# Altium project UltraZohm_Digital_Incremental_Encoder_v2.PrjPCB
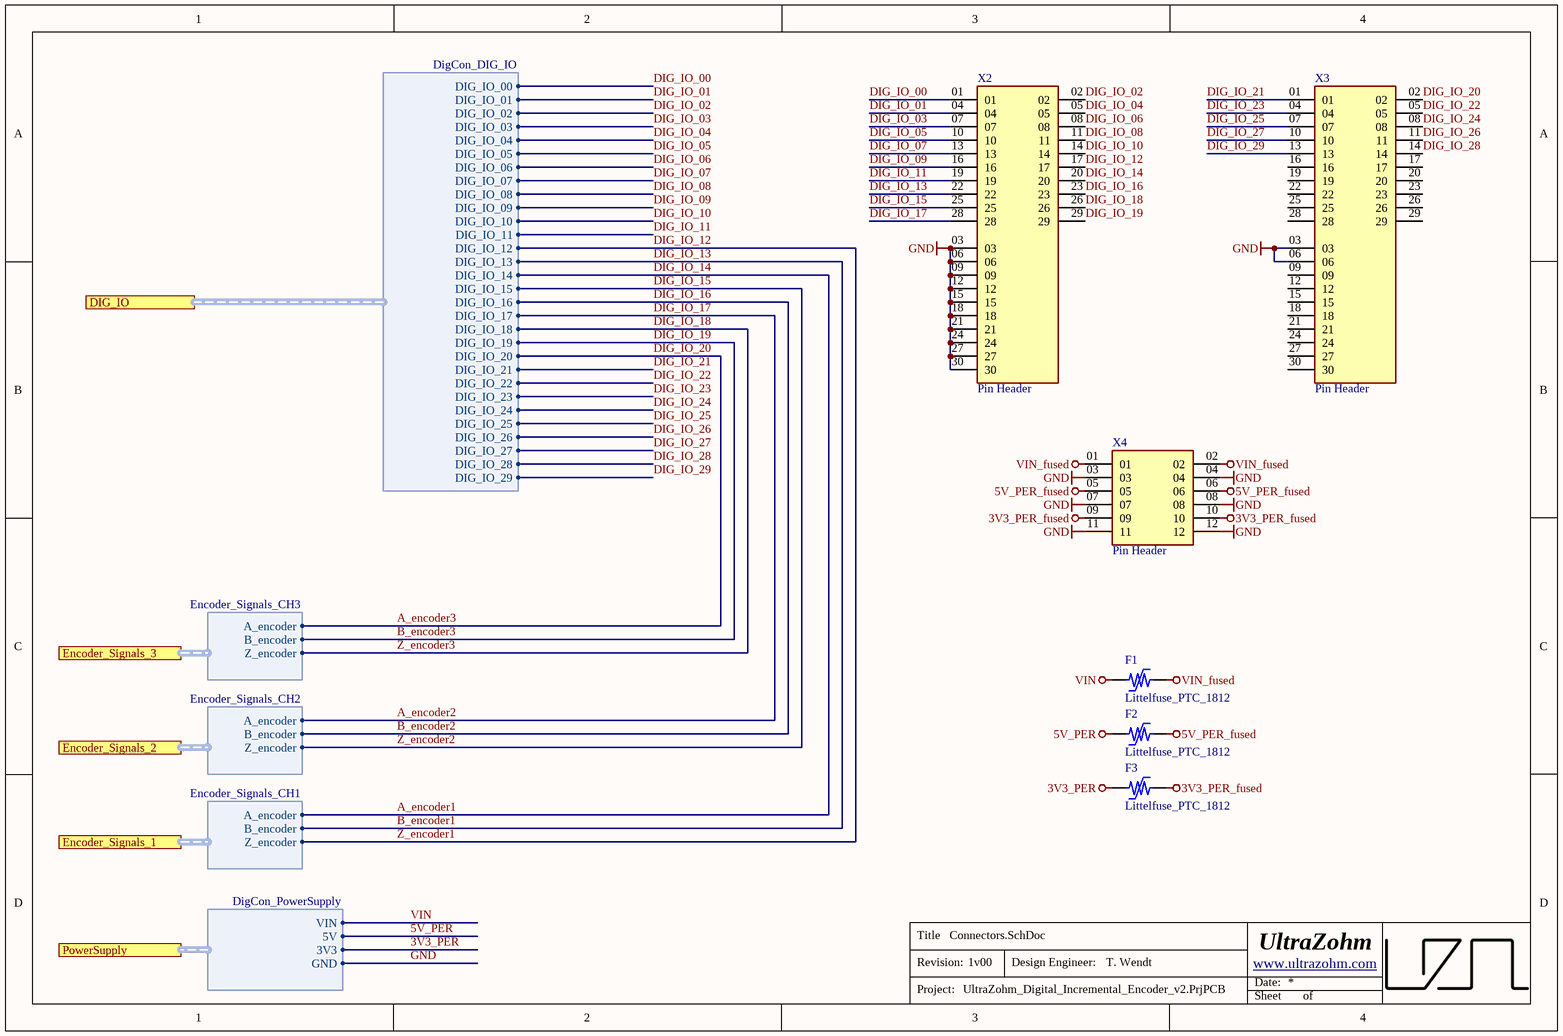
[diagram p0: Connectors.SchDoc]
Author: T. Wendt; AuthorParam: T. Wendt; Date: 11/2019; FinDate: 2020/01; ProjectNameCustom: UltraZohm_DigitalVoltage; ProjectRevision: 1v00
4 sheets, 45 parts. Net scope: hierarchical (ports join the sheet entries above them; power ports are global).
Board file: UZ_D_IncrEncd_v2.PcbDoc
Sheets:
  Connectors.SchDoc
  TopSheet.SchDoc
    CarrierConnector = DigitalCarrierJack.SchDoc
  Encoder.SchDoc

## Sheet Connectors.SchDoc
size A4; Author: T. Wendt; CompanyName: Technische Hochschule Nürnberg Georg Simon Ohm; Organization: UltraZohm; Address1: Kesslerplatz 12; Address2: 90489 Nürnberg; Address3: GERMANY; Website: www.ultrazohm.com

### Parts
(Parts that share a designator on the sheet are numbered #1, #2 ... from top to bottom, then left to right.)
F1#1  Littelfuse_PTC_1812  [1812_PTC_Polyfuse_Littelfuse]
F2#1  Littelfuse_PTC_1812  [1812_PTC_Polyfuse_Littelfuse]
F3#1  Littelfuse_PTC_1812  [1812_PTC_Polyfuse_Littelfuse]
X2#1  Pin Header  [SAMTEC_TSW-110-07-F-T]
X3#1  Pin Header  [SAMTEC_TSW-110-07-F-T]
X4#1  Pin Header  [SAMTEC_TSW-106-07-F-D]

### Ports
DIG_IO (harness DigCon_DIG_IO), Encoder_Signals_1 (harness Encoder_Signals_CH1), Encoder_Signals_2 (harness Encoder_Signals_CH2), Encoder_Signals_3 (harness Encoder_Signals_CH3), PowerSupply (harness DigCon_PowerSupply)

### Harnesses
Encoder_Signals_CH3: A_encoder, B_encoder, Z_encoder
Encoder_Signals_CH2: A_encoder, B_encoder, Z_encoder
Encoder_Signals_CH1: A_encoder, B_encoder, Z_encoder
DigCon_DIG_IO: DIG_IO_01, DIG_IO_02, DIG_IO_03, DIG_IO_04, DIG_IO_05, DIG_IO_06, DIG_IO_07, DIG_IO_08, DIG_IO_09, DIG_IO_10, DIG_IO_11, DIG_IO_12, DIG_IO_13, DIG_IO_14, DIG_IO_15, DIG_IO_16, DIG_IO_17, DIG_IO_18, DIG_IO_19, DIG_IO_20, DIG_IO_21, DIG_IO_22, DIG_IO_23, DIG_IO_24, DIG_IO_25, DIG_IO_26, DIG_IO_27, DIG_IO_28, DIG_IO_29, DIG_IO_00
DigCon_PowerSupply: GND, 3V3, 5V, VIN

### Nets
3V3_PER: F3#1.1 ; port PowerSupply.3V3
3V3_PER_fused: F3#1.2 X4#1.09 X4#1.10
5V_PER: F2#1.1 ; port PowerSupply.5V
5V_PER_fused: F2#1.2 X4#1.05 X4#1.06
GND: X2#1.03 X2#1.06 X2#1.09 X2#1.12 X2#1.15 X2#1.18 X2#1.21 X2#1.24 X2#1.27 X2#1.30 X3#1.03 X3#1.06 X4#1.03 X4#1.04 X4#1.07 X4#1.08 X4#1.11 X4#1.12 ; port PowerSupply.GND
VIN: F1#1.1 ; port PowerSupply.VIN
VIN_fused: F1#1.2 X4#1.01 X4#1.02
A_encoder1: X2#1.20 ; port Encoder_Signals_1.A_encoder, port DIG_IO.DIG_IO_14  [also labelled DIG_IO_14]
A_encoder2: X2#1.28 ; port Encoder_Signals_2.A_encoder, port DIG_IO.DIG_IO_17  [also labelled DIG_IO_17]
A_encoder3: X3#1.02 ; port Encoder_Signals_3.A_encoder, port DIG_IO.DIG_IO_20  [also labelled DIG_IO_20]
B_encoder1: X2#1.22 ; port Encoder_Signals_1.B_encoder, port DIG_IO.DIG_IO_13  [also labelled DIG_IO_13]
B_encoder2: X2#1.23 ; port Encoder_Signals_2.B_encoder, port DIG_IO.DIG_IO_16  [also labelled DIG_IO_16]
B_encoder3: X2#1.29 ; port Encoder_Signals_3.B_encoder, port DIG_IO.DIG_IO_19  [also labelled DIG_IO_19]
DIG_IO_00: X2#1.01 ; port DIG_IO.DIG_IO_00
DIG_IO_01: X2#1.04 ; port DIG_IO.DIG_IO_01
DIG_IO_02: X2#1.02 ; port DIG_IO.DIG_IO_02
DIG_IO_03: X2#1.07 ; port DIG_IO.DIG_IO_03
DIG_IO_04: X2#1.05 ; port DIG_IO.DIG_IO_04
DIG_IO_05: X2#1.10 ; port DIG_IO.DIG_IO_05
DIG_IO_06: X2#1.08 ; port DIG_IO.DIG_IO_06
DIG_IO_07: X2#1.13 ; port DIG_IO.DIG_IO_07
DIG_IO_08: X2#1.11 ; port DIG_IO.DIG_IO_08
DIG_IO_09: X2#1.16 ; port DIG_IO.DIG_IO_09
DIG_IO_10: X2#1.14 ; port DIG_IO.DIG_IO_10
DIG_IO_11: X2#1.19 ; port DIG_IO.DIG_IO_11
DIG_IO_12: X2#1.17 ; port Encoder_Signals_1.Z_encoder, port DIG_IO.DIG_IO_12  [also labelled Z_encoder1]
DIG_IO_15: X2#1.25 ; port Encoder_Signals_2.Z_encoder, port DIG_IO.DIG_IO_15  [also labelled Z_encoder2]
DIG_IO_18: X2#1.26 ; port Encoder_Signals_3.Z_encoder, port DIG_IO.DIG_IO_18  [also labelled Z_encoder3]
DIG_IO_21: X3#1.01 ; port DIG_IO.DIG_IO_21
DIG_IO_22: X3#1.05 ; port DIG_IO.DIG_IO_22
DIG_IO_23: X3#1.04 ; port DIG_IO.DIG_IO_23
DIG_IO_24: X3#1.08 ; port DIG_IO.DIG_IO_24
DIG_IO_25: X3#1.07 ; port DIG_IO.DIG_IO_25
DIG_IO_26: X3#1.11 ; port DIG_IO.DIG_IO_26
DIG_IO_27: X3#1.10 ; port DIG_IO.DIG_IO_27
DIG_IO_28: X3#1.14 ; port DIG_IO.DIG_IO_28
DIG_IO_29: X3#1.13 ; port DIG_IO.DIG_IO_29

Not connected (* = marked no-connect by the designer): X3#1 09 12 15 16 17 18 19 20 21 22 23 24 25 26 27 28 29 30

### Notes on the sheet
- Title
- Revision:
- Design Engineer:
- Date:
- Project:
- Sheet
- of

### Library data of the parts
F1#1 F2#1 F3#1 = Littelfuse_PTC_1812: POLYSWITCH RESETTABLE DEVICES; MPN: miniASMDC110F/24; Value: PTC, 1.1 A, 24V; Voltage: 24V; Trip Current: 2.2A; Hold Current: 1.1A; Resistance: 0.18 Ohm; Type: Fuse; Nominal current: 1 A; Created from: MHlatky; MF: Littelfuse; Created: 2019_02_10_AGeiger; Package: 1812; ComponentLink1URL: https://www.littelfuse.com/~/media/electronics/datasheets/resettable_ptcs/littelfuse_ptc_surface_mount_catalog_datasheet.pdf.pdf; ComponentLink1Description: Datasheet; Manufacturer Part Number: Littelfuse_PTC_1812; PartID: 5; Created On: 07.05.2021 06:50:33; Component Type: Littelfuse_PTC_1812; Last Updated: 10.03.2022 18:07:30; Manufacturer: Littelfuse; Mounting Type: SMD; Operating Temperature: -40 - 85 °C; Supplier 1: Mouser; Supplier Part Number 1: 530-0ZCG0150BF2C; Live Cycle Status: 1
X2#1 X3#1 = TSW-110-07-F-T: THROUGH-HOLE .025" SQ POST HEADER; Manufacturer: SAMTEC; MF: Samtec Inc.; Created from: MHlatky; Value: *; MP: TSW-110-07-F-T; Package: None; Price: None; Availability: Unavailable; Manufacturer Part Number: TSW-110-07-F-T; PartID: 7; Created On: 22.11.2021 15:31:45; ComponentLink1Description: Datasheet; ComponentLink1URL: https://www.mouser.de/datasheet/2/527/tsw_th-2854687.pdf; Component Type: Pin Header; Device Package: THT; Last Updated: 20.12.2021 07:38:08; Mounting Type: THT; Operating Temperature: -55 +125 °C; Series: TSW; Supplier 1: Mouser; Supplier Part Number 1: 200-TSW11007FT; Type: Pin Header; Live Cycle Status: 1; Stock number: not stored
X4#1 = TSW-106-07-F-D: THROUGH-HOLE .025" SQ POST HEADER; MF: Samtec; Created from: MHlatky; MP: TSW-106-07-F-D; Price: None; Package: None; Value: *; Availability: Unavailable; Manufacturer Part Number: TSW-106-07-F-D; PartID: 8; Created On: 22.11.2021 15:31:45; ComponentLink1Description: Datasheet; ComponentLink1URL: https://www.mouser.de/datasheet/2/527/tsw_th-2854687.pdf; Component Type: Pin Header; Device Package: THT; Last Updated: 20.12.2021 07:38:08; Manufacturer: SAMTEC; Mounting Type: THT; Operating Temperature: -55 +125 °C; Series: TSW; Supplier 1: Mouser; Supplier Part Number 1: 200-TSW10607FD; Type: Pin Header; Live Cycle Status: 1; Stock number: not stored

## Sheet TopSheet.SchDoc
size A4; Author: T. Wendt; CompanyName: Technische Hochschule Nürnberg Georg Simon Ohm; Organization: UltraZohm; Address1: Kesslerplatz 12; Address2: 90489 Nürnberg; Address3: GERMANY; DocumentNumber: 1; SheetNumber: 1; SheetTotal: 3; Website: www.ultrazohm.com
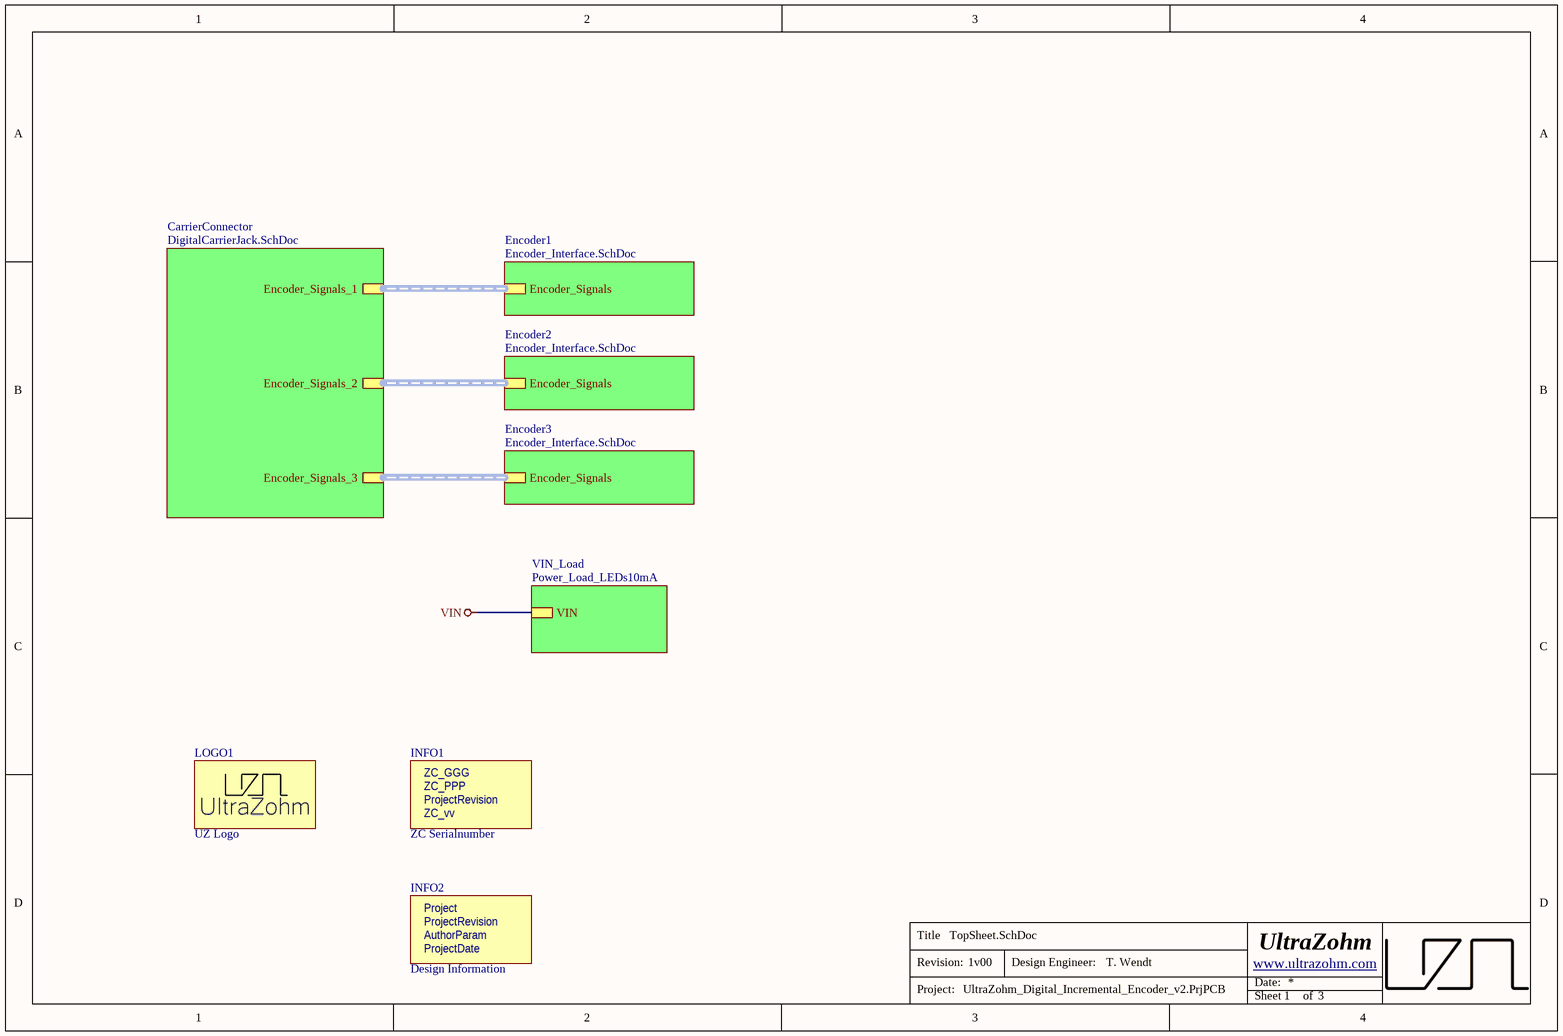
[diagram p1: TopSheet.SchDoc]

### Parts
INFO1  ZC Serialnumber  [ZC-Serial]  (no BOM)
INFO2  Design Information  [Design_info]  (no BOM)
LOGO1  UZ Logo  [UZ_Logo_small]  (no BOM)

### Sub-sheets
CarrierConnector = DigitalCarrierJack.SchDoc: Encoder_Signals_2 (harness Encoder_Signals), Encoder_Signals_1 (harness Encoder_Signals), Encoder_Signals_3 (harness Encoder_Signals)
Encoder1 = Encoder_Interface.SchDoc (file not in this document): Encoder_Signals (harness Encoder_Signals)
Encoder2 = Encoder_Interface.SchDoc (file not in this document): Encoder_Signals (harness Encoder_Signals)
Encoder3 = Encoder_Interface.SchDoc (file not in this document): Encoder_Signals (harness Encoder_Signals)
VIN_Load = Power_Load_LEDs10mA (file not in this document): VIN

### Buses and harness runs
harness sheet CarrierConnector/Encoder_Signals_1 = sheet Encoder1/Encoder_Signals
harness sheet CarrierConnector/Encoder_Signals_2 = sheet Encoder2/Encoder_Signals
harness sheet CarrierConnector/Encoder_Signals_3 = sheet Encoder3/Encoder_Signals

### Notes on the sheet
- Title
- Revision:
- Design Engineer:
- Date:
- Project:
- Sheet
- of
- (in symbol Design Information) Project; ProjectRevision; AuthorParam; ProjectDate
- (in symbol ZC-Serial) ZC_GGG; ZC_PPP; ProjectRevision; ZC_vv

### Library data of the parts
INFO1 = ZC-Serial: Manufacturer: UltraZohm; Value: GGG-PPP-VVvv; Created from: FRosner; Manufacturer Part Number: ZC-Serial; PartID: 58; Created On: 15/04/2025 09:17:14; ComponentLink1Description: https://docs.ultrazohm.com/; ComponentLink1URL: homepage; Component Type: ZC Serialnumber; Last Updated: 15/04/2025 09:17:14; Supplier 1: -; Supplier Part Number 1: -; Type: Serial Number; Live Cycle Status: 1
INFO2 = Design Information: Manufacturer: UltraZohm; Created from: MGremer; Manufacturer Part Number: Design Information; PartID: 12; Created On: 03/11/2021 09:04:23; ComponentLink1Description: https://docs.ultrazohm.com/; ComponentLink1URL: homepage; Component Type: Design Information; Last Updated: 15/04/2025 09:29:36; Supplier 1: -; Supplier Part Number 1: -; Type: Design Information; Value: Design Information; Live Cycle Status: 1
LOGO1 = Logo small: Manufacturer: UltraZohm; Created from: MGremer; Created: Jan2021_Liegmann; Value: Logo; Manufacturer Part Number: Logo small; PartID: 10; Created On: 03.11.2021 09:04:23; ComponentLink1Description: https://docs.ultrazohm.com/; ComponentLink1URL: homepage; Component Type: Logo; Last Updated: 03.11.2021 09:05:50; Supplier 1: -; Supplier Part Number 1: -; Type: Logo; Live Cycle Status: 1

## Sheet DigitalCarrierJack.SchDoc
size A4; Author: T. Wendt; CompanyName: Technische Hochschule Nürnberg Georg Simon Ohm; Organization: UltraZohm; Address1: Kesslerplatz 12; Address2: 90489 Nürnberg; Address3: GERMANY; DocumentNumber: 2; SheetNumber: 2; SheetTotal: 3; Website: www.ultrazohm.com
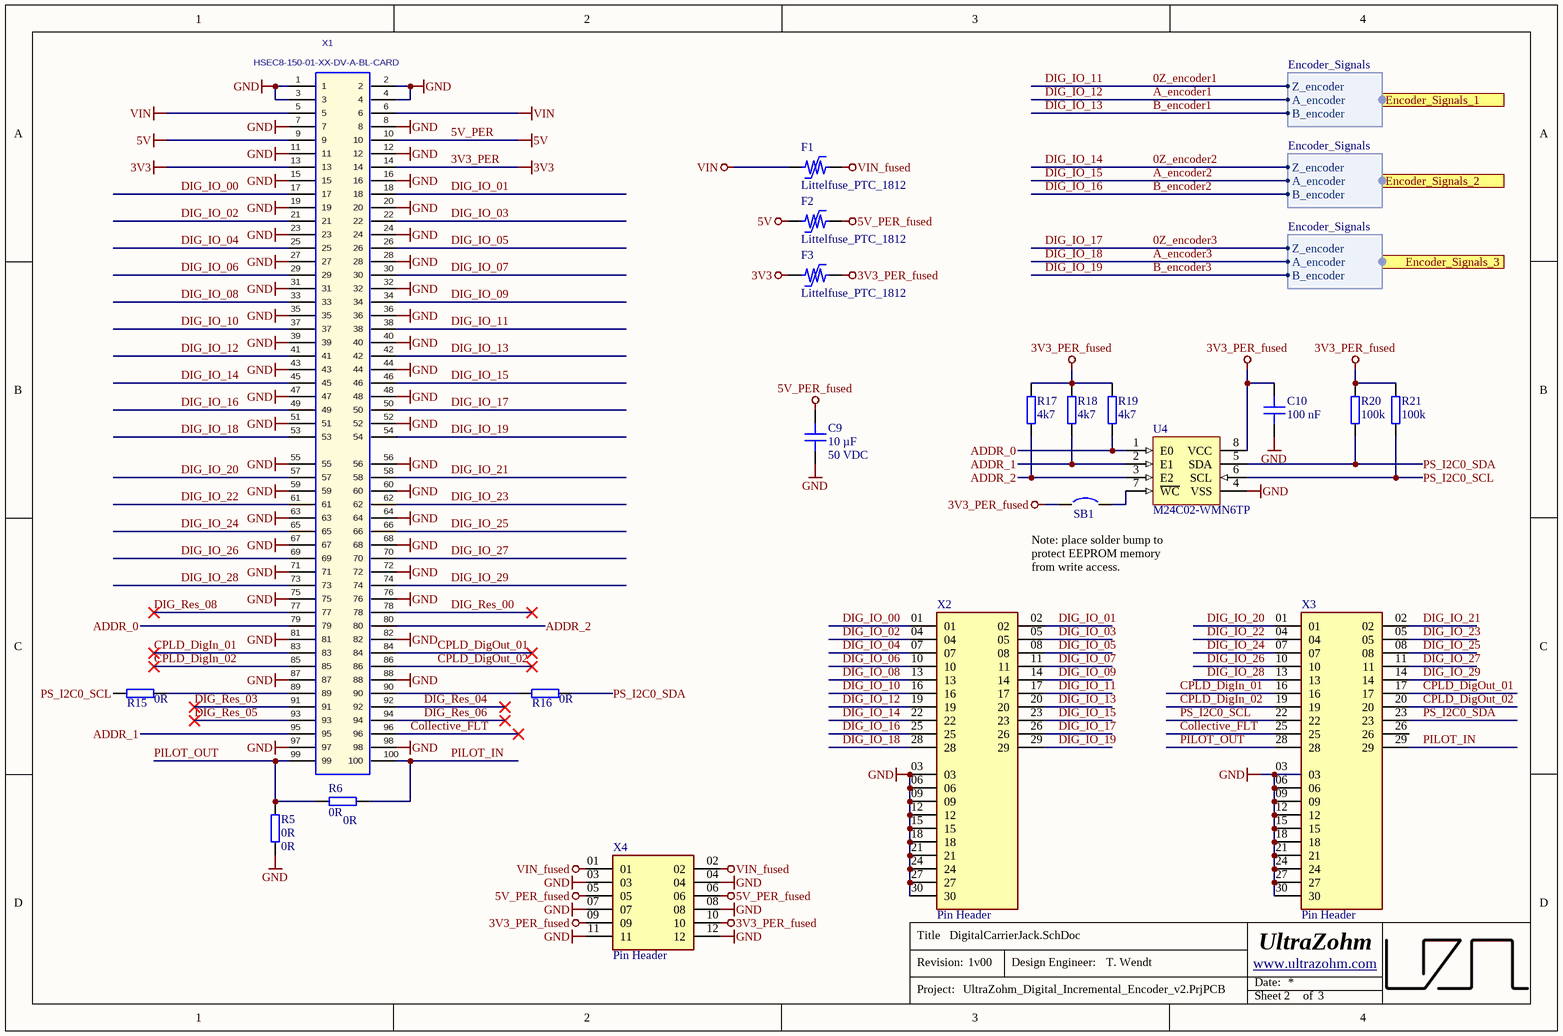
[diagram p2: DigitalCarrierJack.SchDoc]

### Parts
(Parts that share a designator on the sheet are numbered #1, #2 ... from top to bottom, then left to right.)
C9  10 µF  Voltage Rating: 50 VDC  [C_1206]
C10  100 nF  [C_0603]
F1#2  Littelfuse_PTC_1812  [1812_PTC_Polyfuse_Littelfuse]
F2#2  Littelfuse_PTC_1812  [1812_PTC_Polyfuse_Littelfuse]
F3#2  Littelfuse_PTC_1812  [1812_PTC_Polyfuse_Littelfuse]
R5  0R  [RES 0603_1608]
R6  0R  [RES 0603_1608]
R15  0R  [RES 0603_1608]
R16  0R  [RES 0603_1608]
R17  4k7  [RES 0603_1608]
R18  4k7  [RES 0603_1608]
R19  4k7  [RES 0603_1608]
R20  100k  [RES 0603_1608]
R21  100k  [RES 0603_1608]
SB1  (no value)  [SB_0603]  (no BOM)
U4  M24C02-WMN6TP  [D0008A_N]
X1  HSEC8-150-01-XX-DV-A-BL-CARD  [HSEC8-150-01-XX-DV-A-BL-CARD]  (no BOM)
X2#2  Pin Header  [SAMTEC_TSW-110-07-F-T]
X3#2  Pin Header  [SAMTEC_TSW-110-07-F-T]
X4#2  Pin Header  [SAMTEC_TSW-106-07-F-D]

### Ports
Encoder_Signals_1 (harness Encoder_Signals), Encoder_Signals_2 (harness Encoder_Signals), Encoder_Signals_3 (harness Encoder_Signals)

### Harnesses
Encoder_Signals: A_encoder, B_encoder, Z_encoder

### Nets
3V3_PER: F3#2.1 X1.13 X1.14  [also labelled 3V3]
3V3_PER_fused: C10.2 F3#2.2 R17.2 R18.2 R19.2 R20.2 R21.2 SB1.1 U4.8(VCC) X4#2.09 X4#2.10
5V_PER: F2#2.1 X1.9 X1.10  [also labelled 5V]
5V_PER_fused: C9.2 F2#2.2 X4#2.05 X4#2.06
GND: C9.1 C10.1 R5.1 U4.4(VSS) X1.1 X1.2 X1.3 X1.4 X1.7 X1.8 X1.11 X1.12 X1.15 X1.16 X1.19 X1.20 X1.23 X1.24 X1.27 X1.28 X1.31 X1.32 X1.35 X1.36 X1.39 X1.40 X1.43 X1.44 X1.47 X1.48 X1.51 X1.52 X1.55 X1.56 X1.59 X1.60 X1.63 X1.64 X1.67 X1.68 X1.71 X1.72 X1.75 X1.76 X1.81 X1.82 X1.87 X1.88 X1.97 X1.98 X2#2.03 X2#2.06 X2#2.09 X2#2.12 X2#2.15 X2#2.18 X2#2.21 X2#2.24 X2#2.27 X2#2.30 X3#2.03 X3#2.06 X3#2.09 X3#2.12 X3#2.15 X3#2.18 X3#2.21 X3#2.24 X3#2.27 X3#2.30 X4#2.03 X4#2.04 X4#2.07 X4#2.08 X4#2.11 X4#2.12
VIN: F1#2.1 X1.5 X1.6
VIN_fused: F1#2.2 X4#2.01 X4#2.02
0Z_encoder1: X1.38 X2#2.17 ; port Encoder_Signals_1.Z_encoder  [also labelled DIG_IO_11]
0Z_encoder2: X1.45 X2#2.22 ; port Encoder_Signals_2.Z_encoder  [also labelled DIG_IO_14]
0Z_encoder3: X1.50 X2#2.26 ; port Encoder_Signals_3.Z_encoder  [also labelled DIG_IO_17]
A_encoder1: X1.41 X2#2.19 ; port Encoder_Signals_1.A_encoder  [also labelled DIG_IO_12]
A_encoder2: X1.46 X2#2.23 ; port Encoder_Signals_2.A_encoder  [also labelled DIG_IO_15]
A_encoder3: X1.53 X2#2.28 ; port Encoder_Signals_3.A_encoder  [also labelled DIG_IO_18]
ADDR_0: R19.1 U4.1(E0) X1.79
ADDR_1: R18.1 U4.2(E1) X1.95
ADDR_2: R17.1 U4.3(E2) X1.80
B_encoder1: X1.42 X2#2.20 ; port Encoder_Signals_1.B_encoder  [also labelled DIG_IO_13]
B_encoder2: X1.49 X2#2.25 ; port Encoder_Signals_2.B_encoder  [also labelled DIG_IO_16]
B_encoder3: X1.54 X2#2.29 ; port Encoder_Signals_3.B_encoder  [also labelled DIG_IO_19]
Collective_FLT: X1.96 X3#2.25
CPLD_DigIn_01: X1.83 X3#2.16
CPLD_DigIn_02: X1.85 X3#2.19
CPLD_DigOut_01: X1.84 X3#2.17
CPLD_DigOut_02: X1.86 X3#2.20
DIG_IO_00: X1.17 X2#2.01
DIG_IO_01: X1.18 X2#2.02
DIG_IO_02: X1.21 X2#2.04
DIG_IO_03: X1.22 X2#2.05
DIG_IO_04: X1.25 X2#2.07
DIG_IO_05: X1.26 X2#2.08
DIG_IO_06: X1.29 X2#2.10
DIG_IO_07: X1.30 X2#2.11
DIG_IO_08: X1.33 X2#2.13
DIG_IO_09: X1.34 X2#2.14
DIG_IO_10: X1.37 X2#2.16
DIG_IO_20: X1.57 X3#2.01
DIG_IO_21: X1.58 X3#2.02
DIG_IO_22: X1.61 X3#2.04
DIG_IO_23: X1.62 X3#2.05
DIG_IO_24: X1.65 X3#2.07
DIG_IO_25: X1.66 X3#2.08
DIG_IO_26: X1.69 X3#2.10
DIG_IO_27: X1.70 X3#2.11
DIG_IO_28: X1.73 X3#2.13
DIG_IO_29: X1.74 X3#2.14
DIG_Res_00: X1.78
DIG_Res_03: X1.91
DIG_Res_04: X1.92
DIG_Res_05: X1.93
DIG_Res_06: X1.94
DIG_Res_08: X1.77
PILOT_IN: R6.2 X1.100 X3#2.29
PILOT_OUT: R5.2 R6.1 X1.99 X3#2.28
PS_I2C0_SCL: R15.1 R21.1 U4.6(SCL) X3#2.22
PS_I2C0_SDA: R16.2 R20.1 U4.5(SDA) X3#2.23
NetR15_2: R15.2 X1.89
NetR16_1: R16.1 X1.90
NetSB1_2: SB1.2 U4.7(~{WC})

Not connected (* = marked no-connect by the designer): X3#2 26

### Notes on the sheet
- Note: place solder bump to protect EEPROM memory from write access.
- Title
- Revision:
- Design Engineer:
- Date:
- Project:
- Sheet
- of

### Library data of the parts
C9 = CGA5L1X7R1H106K160AC: Capacitor 1206, 50 VDC, 10 µF, X7R; Manufacturer: TDK; Tolerance: 10 %; Created from: MGremer; Manufacturer Part Number: CGA5L1X7R1H106K160AC; PartID: 25; Created On: 20.12.2020 13:54:13; ComponentLink1Description: Datasheet; ComponentLink1URL: https://product.tdk.com/info/en/catalog/datasheets/mlcc_automotive_general_en.pdf; Component Type: Capacitor 1206; Device Package: 1206; Last Updated: 27.05.2022 14:15:21; Mounting Type: SMD; Operating Temperature: -55 - 125°C; Series: CGA; Supplier 1: Mouser; Supplier Part Number 1: 810-CGA5L1X7R1H106K1; Type: Capacitor; Value: 10 µF; Live Cycle Status: 1; LCSC Part Number: C13585; Stock number: Labor SMD Container
C10 = CC0603KRX7R9BB104: Capacitor 0603, 50 VDC, 100 nF, X7R; Manufacturer: YAGEO; Tolerance: 10 %; Voltage Rating: 50 VDC; Created from: AGeiger; Manufacturer Part Number: CC0603KRX7R9BB104; PartID: 102; Created On: 22/08/2022 14:35:53; ComponentLink1Description: Datasheet; ComponentLink1URL: https://datasheet.lcsc.com/lcsc/1809301912_YAGEO-CC0603KRX7R9BB104_C14663.pdf; Component Type: Capacitor 0603; Device Package: 0603; Last Updated: 22/08/2022 14:35:53; Mounting Type: SMD; Operating Temperature: -55 - 125°C; Series: X7R; Supplier 1: LCSC; Supplier Part Number 1: C14663; Supplier 2: Mouser; Supplier Part Number 2: 603-CC603KRX7R9BB104; Type: Capacitor; Value: 100 nF; Live Cycle Status: 1; LCSC Part Number: C14663
F1#2 F2#2 F3#2 = Littelfuse_PTC_1812: as F1#1 on sheet Connectors; MF: Littelfuse; Created: 2019_02_10_AGeiger; Package: 1812; ComponentLink1URL: https://www.littelfuse.com/~/media/electronics/datasheets/resettable_ptcs/littelfuse_ptc_surface_mount_catalog_datasheet.pdf.pdf; ComponentLink1Description: Datasheet; Manufacturer Part Number: Littelfuse_PTC_1812; PartID: 5; Created On: 07.05.2021 06:50:33; Component Type: Littelfuse_PTC_1812; Last Updated: 27.05.2022 15:06:17; Manufacturer: Littelfuse; Mounting Type: SMD; Operating Temperature: -40 - 85 °C; Supplier 1: Mouser; Supplier Part Number 1: 530-0ZCG0150BF2C; Live Cycle Status: 1; LCSC Part Number: C70119
R5 R6 R15 R16 = RC0603JR-070RL: SMD resistor E24 series; Manufacturer: YAGEO; Tolerance: 5%; Created from: MGremer; Manufacturer Part Number: RC0603JR-070RL; PartID: 1; Created On: 14.12.2020 16:17:14; ComponentLink1Description: Datasheet; ComponentLink1URL: https://www.mouser.de/datasheet/2/447/PYu-RC_Group_51_RoHS_L_10-1664068.pdf; Component Type: SMD resistor; Device Package: 0603; Last Updated: 04.03.2021 09:09:42; Mounting Type: SMD; Supplier 1: Mouser; Supplier Part Number 1: 603-RC0603JR-070RL; Supplier 2: LCSC; Supplier Part Number 2: C21189; Type: Resistor; Value: 0R; Live Cycle Status: 1; Stock number: Labor SMD Container; LCSC Part Number: C21189
R17-R19 = RK73B1JTTD472J: SMD resistor E24 series; Manufacturer: KOA Speer; Tolerance: 5%; Created from: MGremer; Manufacturer Part Number: RK73B1JTTD472J; PartID: 90; Created On: 14.12.2020 16:17:14; ComponentLink1Description: Datasheet; ComponentLink1URL: https://www.mouser.de/datasheet/2/219/RK73B-1825463.pdf; Component Type: SMD resistor; Device Package: 0603; Last Updated: 27.05.2022 13:46:16; Mounting Type: SMD; Supplier 1: Mouser; Supplier Part Number 1: 660-RK73B1JTTD472J; Type: Resistor; Value: 4k7; Live Cycle Status: 1; Stock number: Labor SMD Container; LCSC Part Number: C23162
R20 R21 = RK73B1JTTD104J: SMD resistor E24 series; Manufacturer: KOA Speer; Tolerance: 5%; Created from: MGremer; Manufacturer Part Number: RK73B1JTTD104J; PartID: 122; Created On: 14.12.2020 16:17:14; ComponentLink1Description: Datasheet; ComponentLink1URL: https://www.mouser.de/datasheet/2/219/RK73B-1825463.pdf; Component Type: SMD resistor; Device Package: 0603; Last Updated: 27.05.2022 14:04:10; Mounting Type: SMD; Supplier 1: Mouser; Supplier Part Number 1: 660-RK73B1JTTD104J; Type: Resistor; Value: 100k; Live Cycle Status: 1; Stock number: Labor SMD Container; LCSC Part Number: C25803
SB1 = Solder Bump 0603: Created from: AGeiger; Revision: July-2002: Re-released for DXP Platform.; Manufacturer Part Number: Solder Bump 0603; PartID: 1; Created On: 09/01/2024 17:13:56; Component Type: Solder Bump; Device Package: 0603; Last Updated: 02/10/2025 12:53:47; Mounting Type: SMD; Value: Solder Bump 0603
U4 = M24C02-WMN6TP: 2Kbit I2C SOP-8 EEPROM ROHS; Manufacturer: STMicroelectronics; Created from: AGeiger; Manufacturer Part Number: M24C02-WMN6TP; PartID: 1; Created On: 19.11.2023 14:54:27; ComponentLink1Description: Datasheet; ComponentLink1URL: https://www.st.com/resource/en/datasheet/m24c01-w.pdf; Component Type: EEPROM; Device Package: SOIC-8; Last Updated: 19.11.2023 21:39:04; Mounting Type: SMD; Operating Temperature: -40 to +85 °C; Series: M24xxx; Supplier 1: Mouser; Supplier Part Number 1: 511-M24C02-WMN6TP; Supplier 2: LCSC; Supplier Part Number 2: C7562; Type: Memory; Value: M24C02-WMN6TP; LCSC Part Number: C7562
X1 = HSEC8-150-01-XX-DV-A-BL-CARD: Mating Card Layout for HSEC8-150-01-XX-DV-A-BL; Manufacturer: SAMTEC; Created: 2018_04_23_AGeiger; Value: HSEC8-150-01-XX-DV-A-BL-CARD
X2#2 X3#2 = TSW-110-07-F-T: as X2#1 on sheet Connectors; Value: *; MP: TSW-110-07-F-T; Package: None; Price: None; Availability: Unavailable; Manufacturer Part Number: TSW-110-07-F-T; PartID: 7; Created On: 22.11.2021 15:31:45; ComponentLink1Description: Datasheet; ComponentLink1URL: https://www.mouser.de/datasheet/2/527/tsw_th-2854687.pdf; Component Type: Pin Header; Device Package: THT; Last Updated: 20.12.2021 07:38:08; Mounting Type: THT; Operating Temperature: -55 +125 °C; Series: TSW; Supplier 1: Mouser; Supplier Part Number 1: 200-TSW11007FT; Type: Pin Header; Live Cycle Status: 1; Stock number: not stored
X4#2 = TSW-106-07-F-D: as X4#1 on sheet Connectors; MP: TSW-106-07-F-D; Price: None; Package: None; Value: *; Availability: Unavailable; Manufacturer Part Number: TSW-106-07-F-D; PartID: 8; Created On: 22.11.2021 15:31:45; ComponentLink1Description: Datasheet; ComponentLink1URL: https://www.mouser.de/datasheet/2/527/tsw_th-2854687.pdf; Component Type: Pin Header; Device Package: THT; Last Updated: 20.12.2021 07:38:08; Manufacturer: SAMTEC; Mounting Type: THT; Operating Temperature: -55 +125 °C; Series: TSW; Supplier 1: Mouser; Supplier Part Number 1: 200-TSW10607FD; Type: Pin Header; Live Cycle Status: 1; Stock number: not stored

## Sheet Encoder.SchDoc
size A4; Author: Michaela Hlatky; CompanyName: Technische Hochschule Nürnberg Georg Simon Ohm; Address1: Fürther Straße 250; Address2: 90429 Nürnberg; Address3: GERMANY; Revision: 2v00; SheetNumber: 4; SheetTotal: 4; CompanyName2: Institut ELSYS
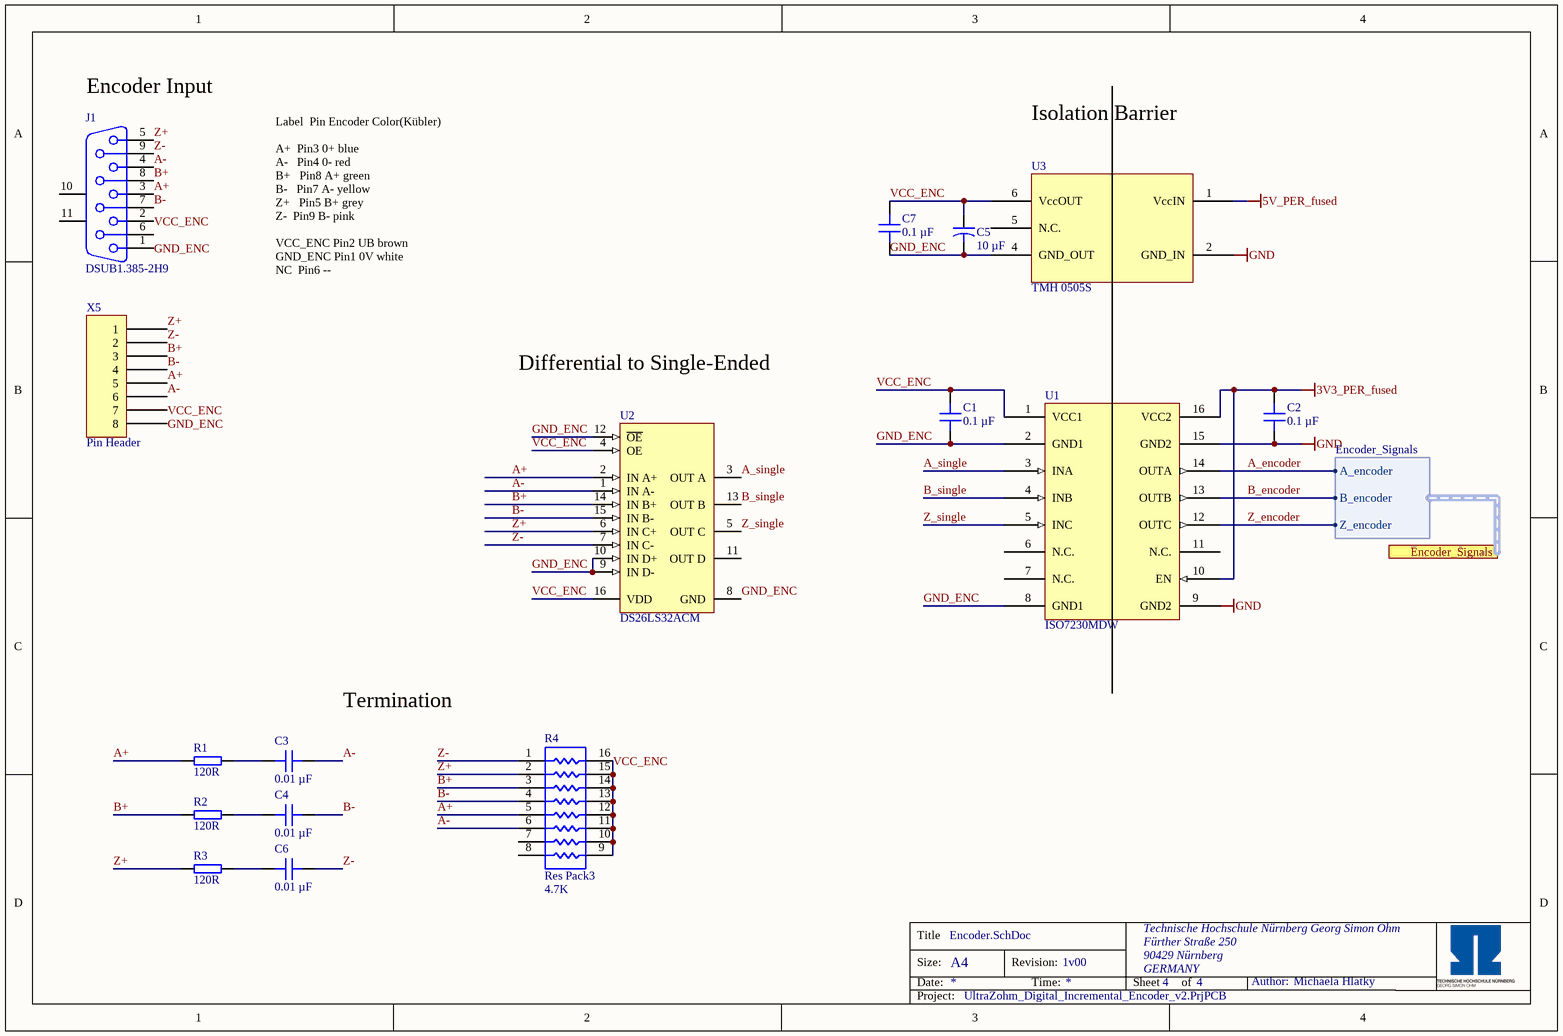
[diagram p3: Encoder.SchDoc]

### Parts
C1  0.1 µF  [C_0805]
C2  0.1 µF  [C_0805]
C3  0.01 µF  [C_0805]
C4  0.01 µF  [C_0805]
C5  10 µF  [CAPR5-4X5]
C6  0.01 µF  [C_0805]
C7  0.1 µF  [C_0805]
J1  DSUB1.385-2H9  [DSUB1.385-2H9]
R1  120R  [RES 0603_1608]
R2  120R  [RES 0603_1608]
R3  120R  [RES 0603_1608]
R4  Res Pack3  value 4.7K  [SO-16_N]
U1  ISO7230MDW  [TI ISO7230 SOIC]
U2  DS26LS32ACM  [M16A_M]
U3  TMH 0505S  [SIL-6(7)]
X5  Pin Header  [HDR1X8]

### Ports
Encoder_Signals (harness Encoder_Signals)

### Harnesses
Encoder_Signals: A_encoder, B_encoder, Z_encoder

### Nets
3V3_PER_fused: C2.2 U1.10(EN) U1.16(VCC2)
5V_PER_fused: U3.1(VccIN)
GND: C2.1 U1.9(GND2) U1.15(GND2) U3.2(GND_IN)
A+: J1.3 R1.1 R4.5 U2.2(IN_A+) X5.5
A-: C3.2 J1.4 R4.6 U2.1(IN_A-) X5.6
A_encoder: U1.14(OUTA) ; port Encoder_Signals.A_encoder
A_single: U1.3(INA) U2.3(OUT_A)
B+: J1.8 R2.1 R4.3 U2.14(IN_B+) X5.3
B-: C4.2 J1.7 R4.4 U2.15(IN_B-) X5.4
B_encoder: U1.13(OUTB) ; port Encoder_Signals.B_encoder
B_single: U1.4(INB) U2.13(OUT_B)
GND_ENC: C1.1 C5.2 C7.1 J1.1 U1.2(GND1) U1.8(GND1) U2.8(GND) U2.9(IN_D-) U2.10(IN_D+) U2.12(~{OE}) U3.4(GND_OUT) X5.8
VCC_ENC: C1.2 C5.1 C7.2 J1.2 R4.9 R4.10 R4.11 R4.12 R4.13 R4.14 R4.15 R4.16 U1.1(VCC1) U2.4(OE) U2.16(VDD) U3.6(VccOUT) X5.7
Z+: J1.5 R3.1 R4.2 U2.6(IN_C+) X5.1
Z-: C6.2 J1.9 R4.1 U2.7(IN_C-) X5.2
Z_encoder: U1.12(OUTC) ; port Encoder_Signals.Z_encoder
Z_single: U1.5(INC) U2.5(OUT_C)
NetC3_1: C3.1 R1.2
NetC4_1: C4.1 R2.2
NetC6_1: C6.1 R3.2

Not connected (* = marked no-connect by the designer): J1 6 10(MH1) 11(MH2); R4 7 8; U1 6(N.C.) 7(N.C.) 11(N.C.); U2 11(OUT_D); U3 5(N.C.)

### Notes on the sheet
- (near J1) Encoder Input
- Isolation Barrier
- Label		Pin	Encoder	Color(Kübler)
  A+		Pin3	0+	blue
  A- 		Pin4	0-	red
  B+ 		Pin8	A+	green
  B- 		Pin7	A-	yellow
  Z+ 		Pin5	B+	grey
  Z-		Pin9	B-	pink
  VCC_ENC	Pin2	UB	brown
  GND_ENC	Pin1	0V	white
  NC		Pin6	--
- Differential to Single-Ended
- Termination
- Title
- Size:
- Date:
- A4
- Revision:
- Time:
- Sheet
- of
- Author:
- Project:

### Library data of the parts
C1 C2 C7 = C0805C104J5RECTU: Capacitor 0805, 50 VDC, 0.1 µF, X7R; Manufacturer: KEMET; Tolerance: 5 %; Voltage Rating: 50 VDC; Created from: MGremer; Manufacturer Part Number: C0805C104J5RECTU; PartID: 17; Created On: 20.12.2020 13:54:13; ComponentLink1Description: Datasheet; ComponentLink1URL: https://www.mouser.de/datasheet/2/212/KEM_C1002_X7R_SMD-1102033.pdf; Component Type: Capacitor 0805; Device Package: 0805; Last Updated: 20.12.2020 16:34:30; Mounting Type: SMD; Operating Temperature: -55 - 125°C; Series: SMD Comm X7R; Supplier 1: Mouser; Supplier Part Number 1: 80-C0805C104J5RECTU; Type: Capacitor; Value: 0.1 µF; Live Cycle Status: 1; Stock number: Labor SMD Container
C3 C4 C6 = GRM21BR72A103KA01L: Capacitor 0805, 100 VDC, 0.01 µF, X7R; Manufacturer: Murata Electronics; Tolerance: 10 %; Voltage Rating: 100 VDC; Created from: MGremer; Manufacturer Part Number: GRM21BR72A103KA01L; PartID: 86; Created On: 20.12.2020 13:54:13; ComponentLink1Description: Datasheet; ComponentLink1URL: https://www.mouser.de/datasheet/2/281/1/GRM21BR72A103KA01_01C-1986947.pdf; Component Type: Capacitor 0805; Device Package: 0805; Last Updated: 17.11.2021 11:27:00; Mounting Type: SMD; Operating Temperature: -55 - 125°C; Series: GRM; Supplier 1: Mouser; Supplier Part Number 1: 81-GRM21BR72A103K; Type: Capacitor; Value: 0.01 µF; Live Cycle Status: 1; Stock number: not stored
C5 = CAPR5-4X5: Capacitor; 2 Leads; Created from: MHlatky; Published: 23-Sep-2002; PackageReference: CAPR5-4X5; Publisher: Altium Limited; PackageDescription: Capacitor; 2 Leads; Value: 10 µF; Manufacturer Part Number: CAPR5-4X5; PartID: 5; Created On: 25.05.2021 10:46:00; ComponentLink1Description: Datasheet; Component Type: Capacitor; Last Updated: 30.11.2021 13:37:41; Supplier Part Number 1: CAPR5-4X5; Type: Capacitor; Live Cycle Status: 1
J1 = DSUB1.385-2H9: Connector; D Subminiature; 9 Position; Right Angle; Pitch 1.385 mm; Manufacturer: Altium; PackageDocument: O; Positions: 9; Gender: Receptacle; Created from: MHlatky; Published: 15-Jun-2001; LatestRevisionDate: 17-Jul-2002; LatestRevisionNote: Re-released for DXP Platform.; DatasheetDocument: 1-Sep-1999; PackageReference: 788750; Publisher: Altium Limited; Orientation: Right Angle; Manufacturer Part Number: DSUB1.385-2H9; PartID: 15; Created On: 26.01.2021 09:19:51; ComponentLink1Description: Datasheet; ComponentLink1URL: [NULL]; Component Type: DSUB Connector; Device Package: -; Last Updated: 20.12.2021 09:43:18; Type: DSUB Connector; Live Cycle Status: 1; Stock number: not stored
R1-R3 = RK73B1JTTD121J: SMD resistor E24 series; Manufacturer: KOA Speer; Tolerance: 5%; Created from: MGremer; Manufacturer Part Number: RK73B1JTTD121J; PartID: 52; Created On: 14.12.2020 16:17:14; ComponentLink1Description: Datasheet; ComponentLink1URL: https://www.mouser.de/datasheet/2/219/RK73B-1825463.pdf; Component Type: SMD resistor; Device Package: 0603; Last Updated: 02.03.2021 14:07:32; Mounting Type: SMD; Supplier 1: Mouser; Supplier Part Number 1: 660-RK73B1JTTD121J; Type: Resistor; Value: 120R; Live Cycle Status: 1; Stock number: Labor SMD Container
R4 = Res Pack3: SOIC, 16-Leads, Body 9.9x3.9mm, Pitch 1.27mm, IPC Medium Density; Created from: MHlatky; Published: 24-Mar-1999; LatestRevisionDate: 29-May-2009; LatestRevisionNote: IPC-7351 Footprint Added.; PackageReference: SO-16; Publisher: Altium Limited; PackageDescription: 16-Pin Small Outline Integrated Circuit 1.27 mm Pitch; Code_JEDEC: MS-012-AC; Code_IPC: SOIC127P600-16; Manufacturer Part Number: Res Pack3; PartID: 207; Created On: 14.12.2020 16:17:14; ComponentLink1Description: Datasheet; Component Type: Res Pack3; Device Package: SOIC; Last Updated: 20.12.2021 09:54:47; Mounting Type: SMD; Supplier 1: Altium; Type: Resistor; Live Cycle Status: 1
U1 = ISO7230MDW: ISO723xx High-Speed, Triple-Channel Digital Isolators; Manufacturer: Analog Devices; Created from: MHlatky; Manufacturer Part Number: ISO7230MDW; PartID: 5; Created On: 26.01.2021 09:03:43; ComponentLink1Description: Datasheet; ComponentLink1URL: https://www.ti.com/lit/ds/symlink/iso7230m.pdf?HQS=dis-mous-null-mousermode-dsf-pf-null-wwe&ts=1639988443497&ref_url=https%253A%252F%252Fwww.mouser.de%252F; Component Type: Microcontroller; Last Updated: 17.06.2021 08:32:47; Mounting Type: SOIC; Operating Temperature: -40 - +125 °C; Supplier 1: Mouser; Supplier Part Number 1: 595-ISO7230MDW; Type: Microcontroller; Live Cycle Status: 1; Stock number: not stored
U2 = DS26LS32ACM: DS26LS32AC/DS26LS32C/DS26LS32M/DS26LS33M Quad Differential Line Receivers; Manufacturer: Texas Instruments; PackageTopMarking: NSUZXYTTE#*DS26LS32*ACM; PowerWise: N; CompType: Interface IC; Created from: MHlatky; Published: 4-Dec-2008; DatasheetVersion: May-1999; PackageVersion: revJ, Aug-1995; PackageReference: M16A; Publisher: Altium Limited; PackageDescription: Molded Package, SO, .150in Wide, 16 Lead; Supplier 1: Mouser; Supplier Part Number 1: 926-DS26LS32ACM; PartNumber: DS26LS32ACM; RoHS: N; PinCount: 16; Code_JEDEC: MS-012-AC; Code_IPC: SOIC127P600-16; ComponentLink1Description: Datasheet; ComponentLink1URL: https://media.digikey.com/pdf/Data%20Sheets/Texas%20Instruments%20PDFs/DS26LS32AC,C,M,DS26LS33M.pdf; ComponentLink2Description: DS26LS32AC Web Page; ComponentLink2URL: http://www.national.com/pf/DS/DS26LS32AC.html; ComponentLink3Description: M16A Package Page; ComponentLink3URL: http://www.national.com/packaging/folders/m16a.html; Manufacturer Part Number: DS26LS32ACM; PartID: 6; Created On: 26.01.2021 09:03:43; Component Type: Microcontroller; Last Updated: 17.06.2021 08:32:47; Mounting Type: SOIC; Operating Temperature: 0 - 70 °C; Type: Microcontroller; Live Cycle Status: 1; Stock number: not stored
U3 = TMH 0505S: ISOLIERTE DC-DC-WANDLER Product Type: DC/DC; Package Style: SIP; Output Power (W): 2; Input Voltage: 5 VDC +/-10%; Output 1 (Vdc): 5; Output 2 (Vdc): N/A; Output 3 (Vdc): N/A; Manufacturer: Traco; Created from: MHlatky; Manufacturer Part Number: TMH 0505S; PartID: 20; Created On: 16.11.2021 07:44:11; ComponentLink1Description: Datasheet; ComponentLink1URL: https://www.tracopower.com/products/tmh.pdf; Component Type: DC-DC Converter; Device Package: SIP; Last Updated: 16.11.2021 07:44:11; Mounting Type: SMD; Operating Temperature: -40 - 85 °C; Series: TMH; Supplier 1: Mouser; Supplier Part Number 1: 495-TMH-0505S; Type: isolated DC-DC Converter; Live Cycle Status: 1; Stock number: not stored
X5 = HDR1X8: 8 Pin; Created from: MHlatky; Manufacturer Part Number: HDR1X8; PartID: 9; Created On: 22.11.2021 15:31:45; ComponentLink1Description: Datasheet; Component Type: Pin Header; Last Updated: 20.12.2021 07:38:08; Supplier 1: Altium; Supplier Part Number 1: HDR1X8; Type: Pin Header; Live Cycle Status: 1; Stock number: not stored

## Nets that join several sheets
3V3_PER_fused: Connectors (F3#1.2 X4#1.09 X4#1.10), DigitalCarrierJack (11 pins), Encoder (C2.2 U1.10 U1.16)
5V_PER_fused: Connectors (F2#1.2 X4#1.05 X4#1.06), DigitalCarrierJack (C9.2 F2#2.2 X4#2.05 X4#2.06), Encoder (U3.1)
GND: Connectors (18 pins), DigitalCarrierJack (76 pins), Encoder (C2.1 U1.9 U1.15 U3.2)
VIN: Connectors (F1#1.1), DigitalCarrierJack (F1#2.1 X1.5 X1.6)
VIN_fused: Connectors (F1#1.2 X4#1.01 X4#1.02), DigitalCarrierJack (F1#2.2 X4#2.01 X4#2.02)

## Assembly variants
Default: all parts fitted